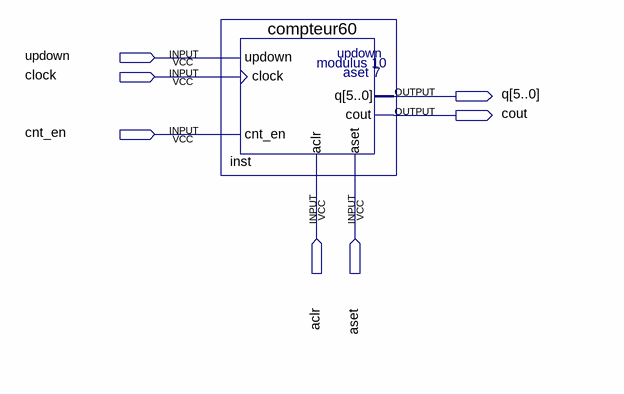
[diagram p0: schematic sheet]
// Quartus schematic 60.bdf as structural Verilog: 1 symbols, 7 pins
module \60  (
  input  updown,
  input  clock,
  input  cnt_en,
  input  aclr,
  input  aset,
  output [5:0] q,
  output cout
);

  compteur60 inst (.updown(updown), .clock(clock), .cnt_en(cnt_en), .aclr(aclr), .aset(aset), .cout(cout), .q(q));
endmodule
